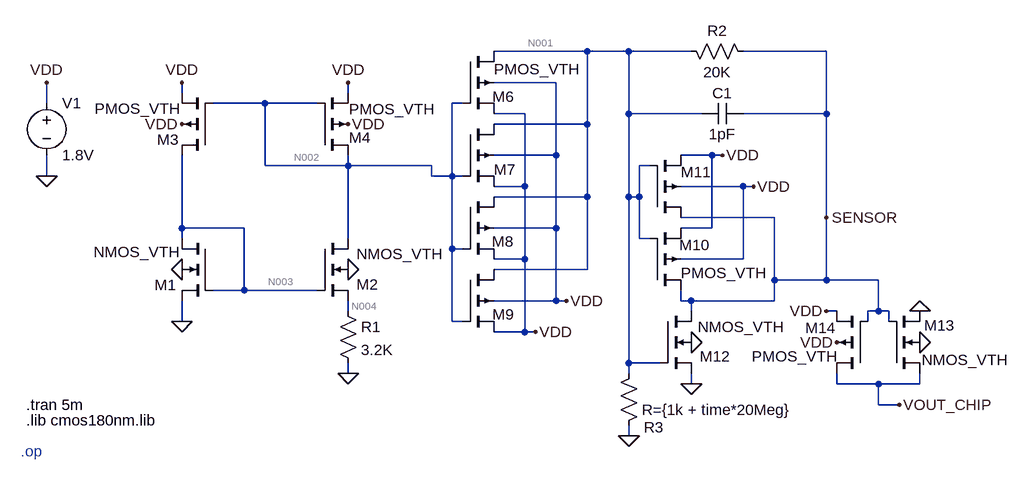
[diagram p0: schematic cmos180nm.asc]
cmos180nm.asc, the LTspice schematic file:
Version 4.1
SHEET 1 2192 852
WIRE 992 64 848 64
WIRE 1056 64 992 64
WIRE 1152 64 1056 64
WIRE 1360 64 1232 64
WIRE 944 112 848 112
WIRE 368 128 368 112
WIRE 624 128 624 112
WIRE 160 144 160 112
WIRE 496 144 416 144
WIRE 576 144 496 144
WIRE 800 144 784 144
WIRE 896 160 848 160
WIRE 1056 160 1056 64
WIRE 1168 160 1056 160
WIRE 1360 160 1360 64
WIRE 1360 160 1232 160
WIRE 992 176 992 64
WIRE 992 176 848 176
WIRE 944 224 944 112
WIRE 944 224 848 224
WIRE 1184 224 1136 224
WIRE 1200 224 1184 224
WIRE 496 240 496 144
WIRE 624 240 624 224
WIRE 624 240 496 240
WIRE 752 240 624 240
WIRE 1088 240 1072 240
WIRE 160 256 160 224
WIRE 752 256 752 240
WIRE 784 256 784 144
WIRE 784 256 752 256
WIRE 800 256 784 256
WIRE 896 272 896 160
WIRE 896 272 848 272
WIRE 1232 272 1136 272
WIRE 1248 272 1232 272
WIRE 992 288 992 176
WIRE 992 288 848 288
WIRE 1056 288 1056 160
WIRE 1072 288 1072 240
WIRE 1072 288 1056 288
WIRE 1280 320 1136 320
WIRE 1360 320 1360 160
WIRE 368 336 368 224
WIRE 464 336 368 336
WIRE 944 336 944 224
WIRE 944 336 848 336
WIRE 1184 336 1184 224
WIRE 1184 336 1136 336
WIRE 368 352 368 336
WIRE 624 352 624 240
WIRE 1072 352 1072 288
WIRE 1088 352 1072 352
WIRE 784 368 784 256
WIRE 800 368 784 368
WIRE 896 384 896 272
WIRE 896 384 848 384
WIRE 1232 384 1232 272
WIRE 1232 384 1136 384
WIRE 992 400 992 288
WIRE 992 400 848 400
WIRE 1280 416 1280 320
WIRE 1360 416 1360 320
WIRE 1360 416 1280 416
WIRE 1440 416 1360 416
WIRE 464 432 464 336
WIRE 464 432 416 432
WIRE 576 432 464 432
WIRE 944 448 944 336
WIRE 944 448 848 448
WIRE 960 448 944 448
WIRE 1136 448 1136 432
WIRE 1152 448 1136 448
WIRE 1280 448 1280 416
WIRE 1280 448 1152 448
WIRE 624 464 624 448
WIRE 1152 464 1152 448
WIRE 1376 464 1360 464
WIRE 1440 464 1440 416
WIRE 1440 464 1424 464
WIRE 1456 464 1440 464
WIRE 368 480 368 448
WIRE 784 480 784 368
WIRE 800 480 784 480
WIRE 1424 480 1424 464
WIRE 1456 480 1456 464
WIRE 896 496 896 384
WIRE 896 496 848 496
WIRE 912 496 896 496
WIRE 1056 544 1056 288
WIRE 1104 544 1056 544
WIRE 624 560 624 544
WIRE 1056 560 1056 544
WIRE 1152 576 1152 560
WIRE 1376 576 1376 560
WIRE 1440 576 1376 576
WIRE 1504 576 1504 560
WIRE 1504 576 1440 576
WIRE 1440 608 1440 576
WIRE 1472 608 1440 608
WIRE 1056 656 1056 640
FLAG 160 112 VDD
FLAG 624 560 0
FLAG 160 256 0
FLAG 624 400 0
FLAG 624 112 VDD
FLAG 368 480 0
FLAG 368 112 VDD
FLAG 1056 656 0
FLAG 368 400 0
FLAG 368 176 VDD
FLAG 624 176 VDD
FLAG 960 448 VDD
FLAG 1376 512 VDD
FLAG 1360 464 VDD
FLAG 1472 608 VOUT_CHIP
FLAG 1504 512 0
FLAG 1504 464 0
FLAG 912 496 VDD
FLAG 1152 576 0
FLAG 1152 512 0
FLAG 1200 224 VDD
FLAG 1248 272 VDD
FLAG 1360 320 SENSOR
SYMBOL nmos4 416 352 M0
WINDOW 0 56 72 Left 2
WINDOW 3 184 21 Right 2
SYMATTR InstName M1
SYMATTR Value NMOS_VTH
SYMATTR Value2 l=180n w=1.8u
SYMBOL voltage 160 128 R0
WINDOW 123 0 0 Left 0
WINDOW 39 0 0 Left 0
SYMATTR InstName V1
SYMATTR Value 1.8V
SYMBOL nmos4 576 352 R0
WINDOW 0 61 71 Left 2
WINDOW 3 61 24 Left 2
SYMATTR InstName M2
SYMATTR Value NMOS_VTH
SYMATTR Value2 l=180n w=7.2u
SYMBOL res 608 448 R0
SYMATTR InstName R1
SYMATTR Value 3.2K
SYMBOL pmos4 576 224 M180
WINDOW 0 49 27 Left 2
WINDOW 3 49 71 Left 2
SYMATTR InstName M4
SYMATTR Value PMOS_VTH
SYMATTR Value2 l=180n w=7.20u
SYMBOL pmos4 416 224 R180
WINDOW 0 52 24 Left 2
WINDOW 3 50 72 Left 2
SYMATTR InstName M3
SYMATTR Value PMOS_VTH
SYMATTR Value2 l=180n w=7.20u
SYMBOL res 1136 48 M90
WINDOW 0 0 56 VBottom 2
WINDOW 3 32 56 VTop 2
SYMATTR InstName R2
SYMATTR Value 20K
SYMBOL cap 1168 144 M90
WINDOW 0 0 32 VBottom 2
WINDOW 3 32 32 VTop 2
SYMATTR InstName C1
SYMATTR Value 1pF
SYMBOL pmos4 800 288 R0
WINDOW 0 45 69 Left 2
WINDOW 3 48 70 Invisible 2
SYMATTR InstName M8
SYMATTR Value PMOS_VTH
SYMATTR Value2 l=180n w=1.8u
SYMBOL res 1040 656 M180
WINDOW 0 39 13 Left 2
WINDOW 3 36 40 Left 2
SYMATTR InstName R3
SYMATTR Value R={1k + time*20Meg}
SYMBOL pmos4 1424 560 R180
WINDOW 0 49 70 Left 2
WINDOW 3 47 26 Left 2
SYMATTR InstName M14
SYMATTR Value PMOS_VTH
SYMATTR Value2 l=180n w=1.8u
SYMBOL nmos4 1456 560 M180
WINDOW 0 55 74 Left 2
WINDOW 3 51 21 Left 2
SYMATTR InstName M13
SYMATTR Value NMOS_VTH
SYMATTR Value2 l=180n w=1.8u
SYMBOL pmos4 800 400 R0
WINDOW 0 46 69 Left 2
WINDOW 3 48 70 Invisible 2
SYMATTR InstName M9
SYMATTR Value PMOS_VTH
SYMATTR Value2 l=180n w=1.8u
SYMBOL pmos4 800 64 R0
WINDOW 0 46 70 Left 2
WINDOW 3 48 27 Left 2
SYMATTR InstName M6
SYMATTR Value PMOS_VTH
SYMATTR Value2 l=180n w=1.8u
SYMBOL pmos4 800 176 R0
WINDOW 0 48 70 Left 2
WINDOW 3 48 70 Invisible 2
SYMATTR InstName M7
SYMATTR Value PMOS_VTH
SYMATTR Value2 l=180n w=1.8u
SYMBOL nmos4 1104 464 R0
WINDOW 0 61 70 Left 2
WINDOW 3 58 24 Left 2
SYMATTR InstName M12
SYMATTR Value NMOS_VTH
SYMATTR Value2 l=180n w=1.8u
SYMBOL pmos4 1088 432 M180
WINDOW 0 46 70 Left 2
WINDOW 3 48 27 Left 2
SYMATTR InstName M10
SYMATTR Value PMOS_VTH
SYMATTR Value2 l=180n w=1.8u
SYMBOL pmos4 1088 320 M180
WINDOW 0 48 70 Left 2
WINDOW 3 48 70 Invisible 2
SYMATTR InstName M11
SYMATTR Value PMOS_VTH
SYMATTR Value2 l=180n w=1.8u
TEXT 128 632 Left 2 !.lib cmos180nm.lib
TEXT 120 680 Left 2 ;.op
TEXT 128 608 Left 2 !.tran 5m

The netlist it stands for:
* cmos180nm.asc
M1 N003 N003 0 0 NMOS_VTH l=180n w=1.8u
V1 VDD 0 1.8V
M2 N002 N003 N004 0 NMOS_VTH l=180n w=7.2u
R1 N004 0 3.2K
M4 N002 N002 VDD VDD PMOS_VTH l=180n w=7.20u
M3 N003 N002 VDD VDD PMOS_VTH l=180n w=7.20u
R2 N001 SENSOR 20K
C1 N001 SENSOR 1pF
M8 N001 N002 VDD VDD PMOS_VTH l=180n w=1.8u
R3 0 N001 R={1k + time*20Meg}
M14 VOUT_CHIP SENSOR VDD VDD PMOS_VTH l=180n w=1.8u
M13 VOUT_CHIP SENSOR 0 0 NMOS_VTH l=180n w=1.8u
M9 N001 N002 VDD VDD PMOS_VTH l=180n w=1.8u
M6 N001 N002 VDD VDD PMOS_VTH l=180n w=1.8u
M7 N001 N002 VDD VDD PMOS_VTH l=180n w=1.8u
M12 SENSOR N001 0 0 NMOS_VTH l=180n w=1.8u
M10 SENSOR N001 VDD VDD PMOS_VTH l=180n w=1.8u
M11 SENSOR N001 VDD VDD PMOS_VTH l=180n w=1.8u
.model NMOS NMOS
.model PMOS PMOS
.lib standard.mos
.lib cmos180nm.lib
* .op
.tran 5m
.backanno
.end

* Results of the author's LTspice run, read from the files saved beside the schematic
* Operating Point, zero values left out:
*   V(n001) = 128.9 mV
*   V(n002) = 955.6 mV
*   V(n003) = 872 mV
*   V(n004) = 80.39 mV
*   V(sensor) = 1.719 V
*   V(vdd) = 1.8 V
*   I(R1) = 25.12 µA
*   I(R2) = -79.52 µA
*   I(R3) = -128.9 µA
*   I(V1) = -181.1 µA
*   Ib(M12) = -1.795 pA
*   Ib(M14) = 1.864 pA
*   Ib(M2) = -1.05 pA
*   Ib(M6) = 15.38 nA
*   Ib(M7) = 15.38 nA
*   Ib(M8) = 15.38 nA
*   Ib(M9) = 15.38 nA
*   Id(M1) = 27.11 µA
*   Id(M10) = -39.76 µA
*   Id(M11) = -39.76 µA
*   Id(M12) = 8.067 pA
*   Id(M13) = 2.945 pA
*   Id(M14) = -2.945 pA
*   Id(M2) = 25.12 µA
*   Id(M3) = -27.11 µA
*   Id(M4) = -25.12 µA
*   Id(M6) = -12.35 µA
*   Id(M7) = -12.35 µA
*   Id(M8) = -12.35 µA
*   Id(M9) = -12.35 µA
*   Is(M1) = -27.11 µA
*   Is(M10) = 39.76 µA
*   Is(M11) = 39.76 µA
*   Is(M12) = -6.272 pA
*   Is(M13) = -2.945 pA
*   Is(M14) = 1.08 pA
*   Is(M2) = -25.12 µA
*   Is(M3) = 27.11 µA
*   Is(M4) = 25.12 µA
*   Is(M6) = 12.33 µA
*   Is(M7) = 12.33 µA
*   Is(M8) = 12.33 µA
*   Is(M9) = 12.33 µA
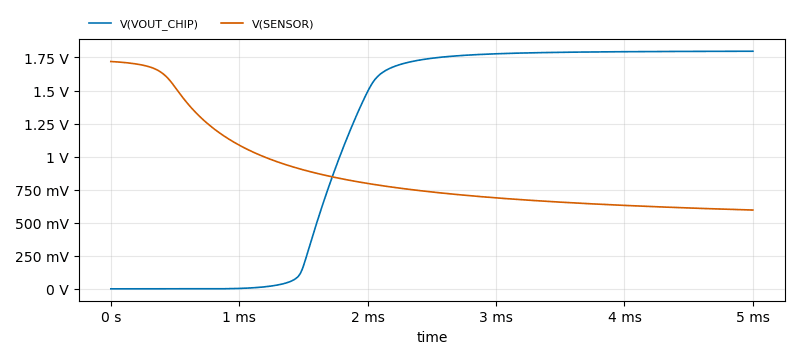
[diagram p1: Transient Analysis of cmos180nm.asc, plotted from the saved traces]
* Transient Analysis, 1 run:
*   V(VOUT_CHIP): min 0 V, max 1.797 V, average 1.153 V, rms 1.404 V, last 1.797 V
*   V(SENSOR): min 595.9 mV, max 1.719 V, average 877.8 mV, rms 938.3 mV, last 595.9 mV